# EAGLE design Amplificador FM Simples (EAGLE 5.06)
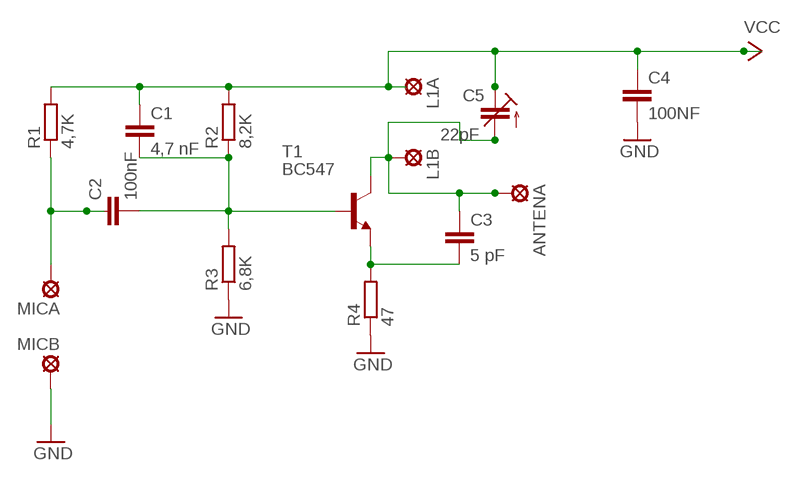
[diagram p0: schematic, sheet 1]

## Parts
ANTENA  MCS08  [MCS08]
C1  4,7 nF  C-EU025-024X044  [C025-024X044]
C2  100nF  C-EU025-024X044  [C025-024X044]
C3  5 pF  C-EU025-024X044  [C025-024X044]
C4  100NF  C-EU025-024X044  [C025-024X044]
C5  22pF  C-TRIMMTZ03  [CTRIMTZ03]
L1A  MCS08  [MCS08]
L1B  MCS08  [MCS08]
MICA  LSP11  [LSP11]
MICB  LSP11  [LSP11]
R1  4,7K  R-EU_0204/7  [0204/7]
R2  8,2K  R-EU_0204/7  [0204/7]
R3  6,8K  R-EU_0204/7  [0204/7]
R4  47  R-EU_0204/7  [0204/7]
T1  BC547  [TO92]

## Nets
GND: C4.2 MICB.MP R3.1 R4.1
N$1: C2.1 MICA.MP R1.1
N$2: C1.2 C2.2 R2.1 R3.2 T1.2(B)
N$4: C3.2 R4.2 T1.1(E)
N$5: ANTENA.MP C3.1 C5.2(A) L1B.MP T1.3(C)
VCC: C1.1 C4.1 C5.1(E) L1A.MP R1.2 R2.2

## Library data of the parts
ANTENA L1A L1B = solpad:MCS08: SOLDER PAD MC S0,8, drill 1.2 mm, distributor Buerklin, 08F130
C1-C4 = rcl:C-EU: CAPACITOR, European symbol
C5 = resistor:C-TRIMM: Trimm capacitor
MICA MICB = solpad:LSP11: SOLDER PAD drill 1.1 mm
R1-R4 = rcl:R-EU_: RESISTOR, European symbol
T1 = transistor:BC547: NPN TRANSISTOR

## Board
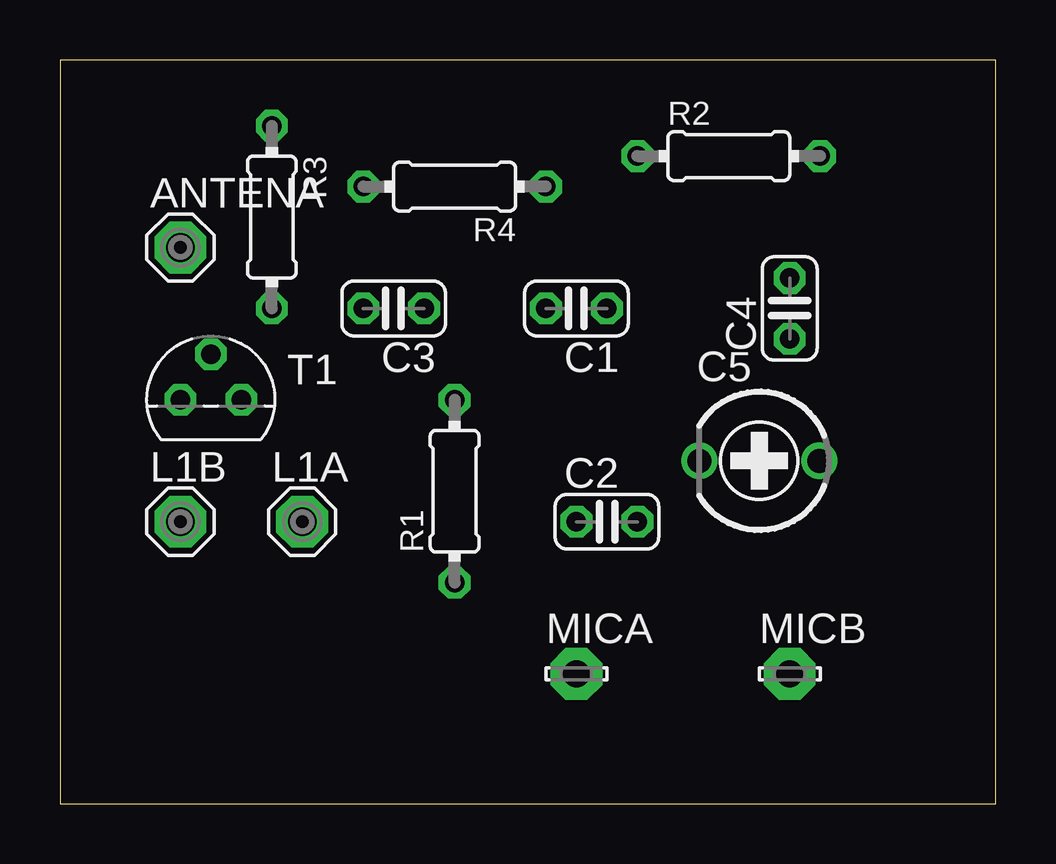
[diagram p1: board, top side]
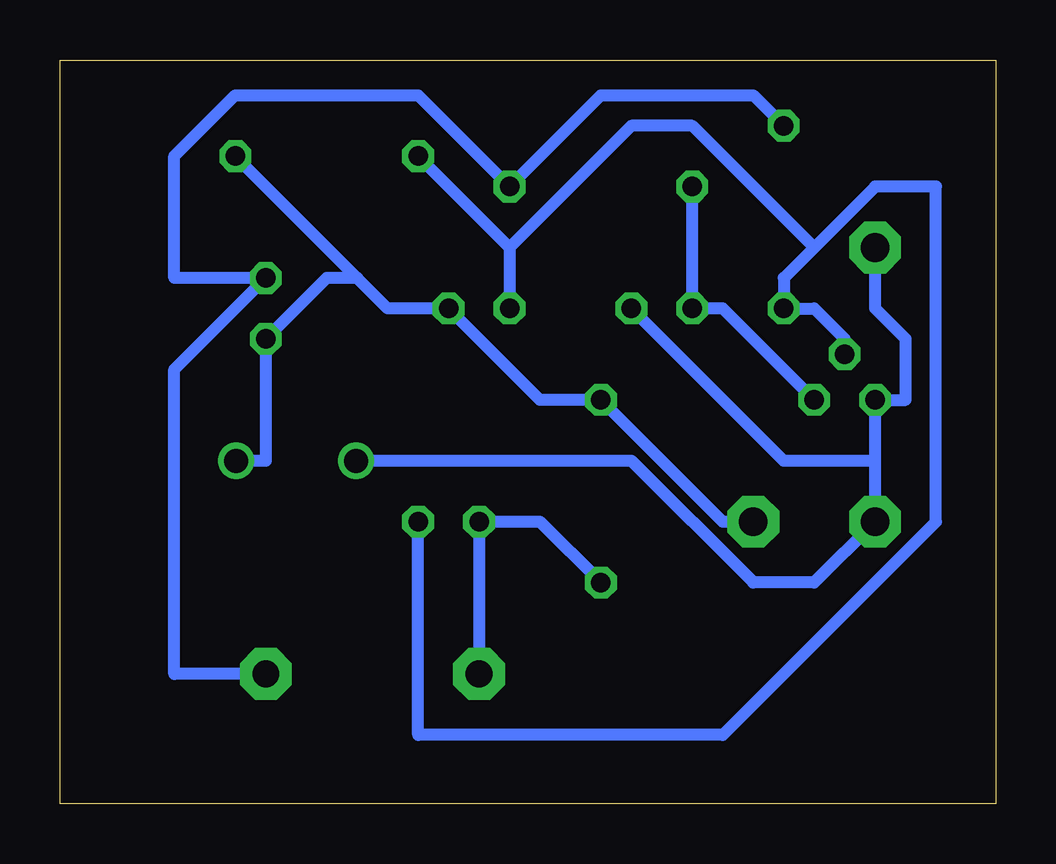
[diagram p2: board, bottom side, seen from below]

Size 39 x 31 mm. Coordinates in mm from the lower left corner, seen from the top.
Outline: 0,0 39,0 39,31 0,31 0,0
Copper layers (1*16): Top 0.035mm / dielectric 1.5mm / Bottom 0mm
Design rules "default *": minimum track width 20mil, minimum drill 24mil, track to track 10mil, track to pad 8mil, pad to pad 8mil, via to via 8mil, smd to smd 8mil, copper to edge 18mil, drill to drill 8mil, minimum pad ring 10mil, minimum via ring 8mil, stop-mask expansion 4mil, vias tented up to drill 0mil, thermal gap 10mil

### Footprints (pad centres in the part's own frame; a part is rotated, then mirrored left to right if it is on the bottom)
MCS08 = drill 1.194 pad 2.159 octagon: MP 0,0
C025-024X044 = drill 0.813 octagon: 1 -1.27,0; 2 1.27,0
CTRIMTZ03 = drill 1 round: 1 0,2.5; 2 0,-2.5
LSP11 = drill 1.118 pad 2.159 octagon: MP 0,0
0204/7 = drill 0.813 octagon: 1 -3.81,0; 2 3.81,0
TO92 = drill 0.813 octagon: 1 1.27,0; 2 0,1.905; 3 -1.27,0

### Placement (x,y rotation side)
ANTENA  5.02,23.18 0 top
C1  21.53,20.64 180 top
C2  22.8,11.75 0 top
C3  13.91,20.64 180 top
C4  30.42,20.64 90 top
C5  29.15,14.29 270 top
L1A  10.1,11.75 0 top
L1B  5.02,11.75 0 top
MICA  21.53,5.4 0 top
MICB  30.42,5.4 0 top
R1  16.45,13.02 90 top
R2  27.88,26.99 0 top
R3  8.83,24.45 270 top
R4  16.45,25.72 180 top
T1  6.29,16.83 0 top

### Tracks (layer width: path | path; a pad name or v marks a point on that pad's centre or on a via)
GND
  Bottom 0.508: R3.1 10.1,29.53 16.45,29.53 R4.1 24.07,29.53 31.69,29.53 34.23,26.99 34.23,21.91 C4.2 34.23,18.1 34.23,5.4 MICB.MP
N$1
  Bottom 0.508: R1.1 18.99,11.75 C2.1 MICA.MP
N$2
  Bottom 0.508: 20.26,23.18 C1.2 | 20.26,23.18 R2.1 | C2.2 24.07,2.86 11.37,2.86 2.48,11.75 2.48,25.72 5.02,25.72 7.56,23.18 | 7.56,23.18 8.83,21.91 R3.2 7.56,20.64 6.29,19.37 T1.2 | 20.26,23.18 15.18,28.26 12.64,28.26 7.56,23.18
N$4
  Bottom 0.508: T1.1 11.37,20.64 C3.2 R4.2
N$5
  Bottom 0.508: 5.02,14.29 L1B.MP 7.56,9.21 10.1,9.21 15.18,14.29 C5.2 | 5.02,14.29 T1.3 3.75,16.83 3.75,19.37 5.02,20.64 ANTENA.MP | C3.1 8.83,14.29 5.02,14.29
VCC
  Bottom 0.508: 31.69,14.29 C5.1 30.42,14.29 C4.1 27.88,21.91 26.61,21.91 | L1A.MP 11.37,11.75 R1.2 18.99,16.83 C1.1 25.34,20.64 26.61,21.91 | 26.61,21.91 R2.2